# Altium schematic sheet tsalledboard.SchDoc
size A
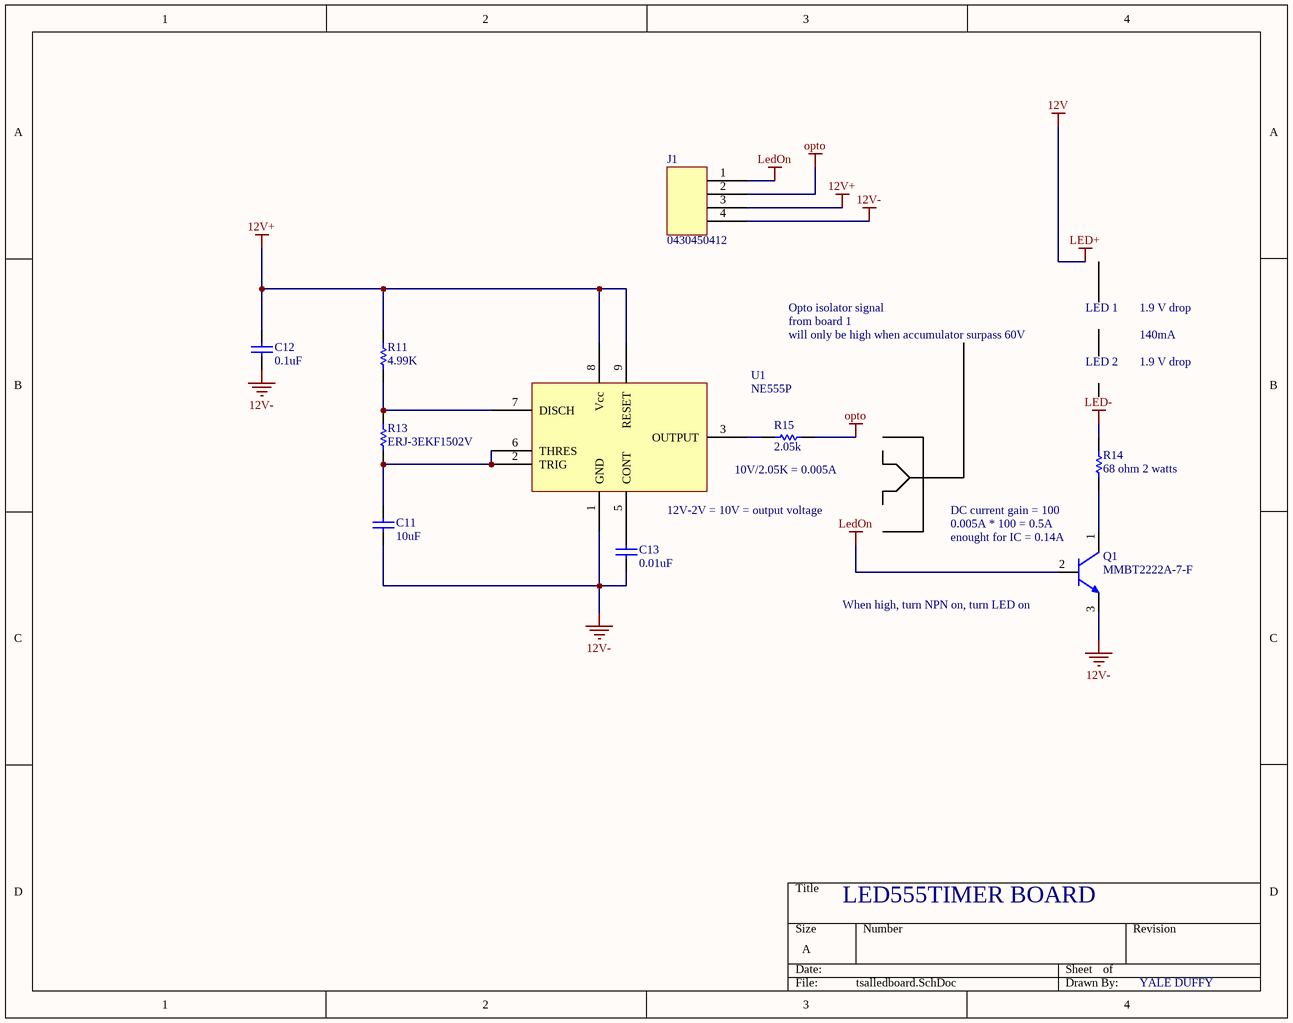
[diagram p0: tsalledboard.SchDoc]

## Parts
C11  10uF  [CAPACITOR 0805]
C12  0.1uF  [CAP 0402]
C13  0.01uF  [CAP 1206]
J1  0430450412  [0430450412]
Q1  MMBT2222A-7-F  [MMBT2222A]
R11  4.99K  [Resistor 0603]
R13  ERJ-3EKF1502V  [Resistor 0603]
R14  68 ohm 2 watts  [CRGP2512F68R]
R15  2.05k  [Resistor 0603]
U1  NE555P  [NE555P]

## Nets
12V+: C12.2 J1.3 R11.1 U1.8(Vcc) U1.9(RESET)
12V-: C11.1 C12.1 C13.1 J1.4 Q1.3(E) U1.1(GND)
LED-: R14.1
LedOn: J1.1 Q1.2(B)
opto: J1.2 R15.2
NetC11_2: C11.2 R13.2 U1.2(TRIG) U1.6(THRES)
NetC13_2: C13.2 U1.5(CONT)
NetQ1_1: Q1.1(C) R14.2
NetR11_2: R11.2 R13.1 U1.7(DISCH)
NetR15_1: R15.1 U1.3(OUTPUT)

## Notes on the sheet
- Opto isolator signal
- from board 1
- will only be high when accumulator surpass 60V
- LED 1
- LED 2
- 140mA
- 1.9 V drop
- 10V/2.05K = 0.005A
- (near U1) 12V-2V = 10V = output voltage
- DC current gain = 100
- (near Q1) 0.005A * 100 = 0.5A
- (near Q1) enought for IC = 0.14A
- (near Q1) When high, turn NPN on, turn LED on
- LED555TIMER BOARD
- YALE DUFFY

## Library data of the parts
C11 = C0805C106K8PACTU: Capacitor, Ceramic, 10UF 10V X5R 0805
C12 = C0402C104K3RAC7867: Capacitor 0.1µF ±10% 25V Ceramic X7R 0402 (1005 Metric)
C13 = GRM3195C1H113JA01D: Capacitor Ceramic 0.011UF 50V C0G/NP0 1206
J1 = 0430450412: Connector Header Through Hole 4 position 0.118" (3.00mm); ComponentLink1Description: Datasheet; ComponentLink1URL: https://www.molex.com/pdm_docs/sd/430450412_sd.pdf; ComponentLink2Description: Supplier; ComponentLink2URL: https://www.digikey.com/product-detail/en/molex/0430450412/WM1790-ND/252503
Q1 = MMBT2222A-7-F: Transistor Bipolar NPN 40V 600mA 300MHz 310mW Surface Mount SOT-23-3
R11 = ERJ-3EKF4991V: Resistor, 4.99k ohms, 0603, SMD
R13 = ERJ-3EKF1502V: Resistor, 15K ohms, 0603, SMD
R14 = CRGP2512F68R: Thick Film Resistors - SMD CRGP 2512 68R 1% SMD Resistor
R15 = ERJ-3EKF2051V: Resistor, 2.05K ohms, 0603, SMD; ComponentLink1Description: Supplier; ComponentLink1URL: https://www.digikey.cn/product-detail/zh/panasonic-electronic-components/ERJ-3EKF2051V/P2-05KHCT-ND/198220; ComponentLink2Description: Datasheet; ComponentLink2URL: https://industrial.panasonic.com/cdbs/www-data/pdf/RDA0000/AOA0000C304.pdf
U1 = NE555P: IC, 555 Type, Timer/Oscillator, IC 100kHz 8-PDIP